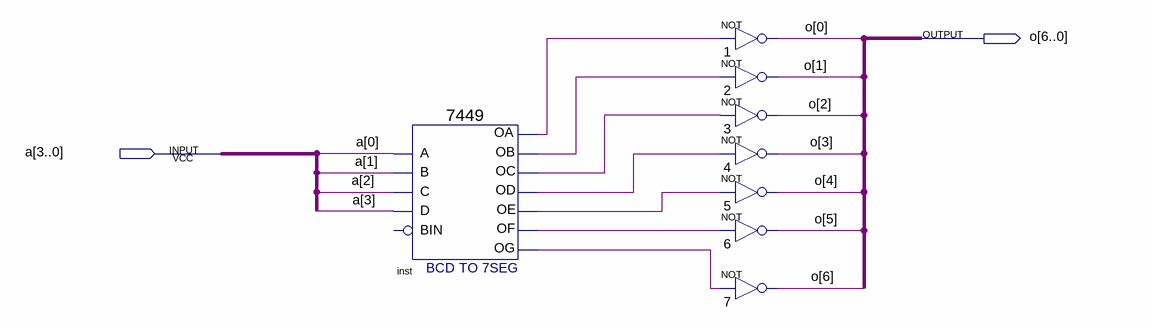
[diagram p0: schematic sheet]
// Quartus schematic decoder_common_anode.bdf as structural Verilog: 8 symbols, 2 pins
module decoder_common_anode (
  input  [3:0] a,
  output [6:0] o
);

  wire inst_oa, inst_ob, inst_oc, inst_od, inst_oe, inst_of, inst_og;

  \7449  inst (
    .A(a[0]), .C(a[2]), .B(a[1]), .D(a[3]), .OC(inst_oc), .OD(inst_od), .OF(inst_of), .OG(inst_og),
    .OB(inst_ob), .OA(inst_oa), .OE(inst_oe));  // open: BIN
  not u_1 (o[0], inst_oa);
  not u_2 (o[1], inst_ob);
  not u_3 (o[2], inst_oc);
  not u_4 (o[3], inst_od);
  not u_5 (o[4], inst_oe);
  not u_6 (o[5], inst_of);
  not u_7 (o[6], inst_og);
endmodule
